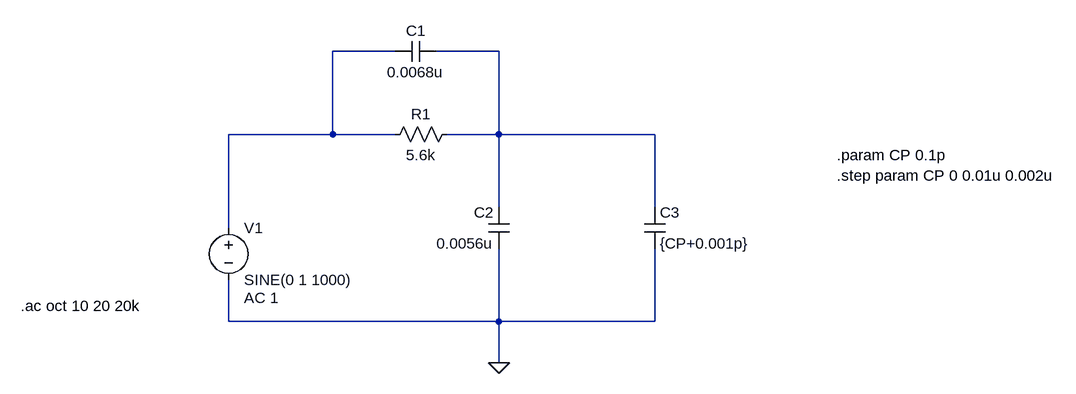
[diagram p0: schematic BD-2 PreTone.asc]
BD-2 PreTone.asc, the LTspice schematic file:
Version 4
SHEET 1 1104 680
WIRE 32 -224 -64 -224
WIRE 192 -224 96 -224
WIRE -64 -96 -64 -224
WIRE -64 -96 -224 -96
WIRE 32 -96 -64 -96
WIRE 192 -96 192 -224
WIRE 192 -96 112 -96
WIRE 432 -96 192 -96
WIRE 192 16 192 -96
WIRE 432 16 432 -96
WIRE -224 48 -224 -96
WIRE -224 192 -224 128
WIRE 192 192 192 80
WIRE 192 192 -224 192
WIRE 432 192 432 80
WIRE 432 192 192 192
WIRE 192 256 192 192
FLAG 192 256 0
SYMBOL voltage -224 32 R0
WINDOW 123 24 124 Left 2
WINDOW 39 0 0 Left 2
SYMATTR InstName V1
SYMATTR Value SINE(0 1 1000)
SYMATTR Value2 AC 1
SYMBOL res 128 -112 R90
WINDOW 0 0 56 VBottom 2
WINDOW 3 32 56 VTop 2
SYMATTR InstName R1
SYMATTR Value 5.6k
SYMBOL cap 96 -240 R90
WINDOW 0 0 32 VBottom 2
WINDOW 3 32 32 VTop 2
SYMATTR InstName C1
SYMATTR Value 0.0068u
SYMBOL cap 208 80 R180
WINDOW 0 24 56 Left 2
WINDOW 3 24 8 Left 2
SYMATTR InstName C2
SYMATTR Value 0.0056u
SYMBOL cap 416 16 R0
SYMATTR InstName C3
SYMATTR Value {CP+0.001p}
TEXT -544 168 Left 2 !.ac oct 10 20 20k
TEXT 712 -64 Left 2 !.param CP 0.1p\n.step param CP 0 0.01u 0.002u

The netlist it stands for:
* BD-2 PreTone.asc
V1 N001 0 SINE(0 1 1000) AC 1
R1 N002 N001 5.6k
C1 N002 N001 0.0068u
C2 0 N002 0.0056u
C3 N002 0 {CP+0.001p}
.ac oct 10 20 20k
.param CP 0.1p
.step param CP 0 0.01u 0.002u
.backanno
.end